# EAGLE design Hyundai giraffe (EAGLE 9.1.0)
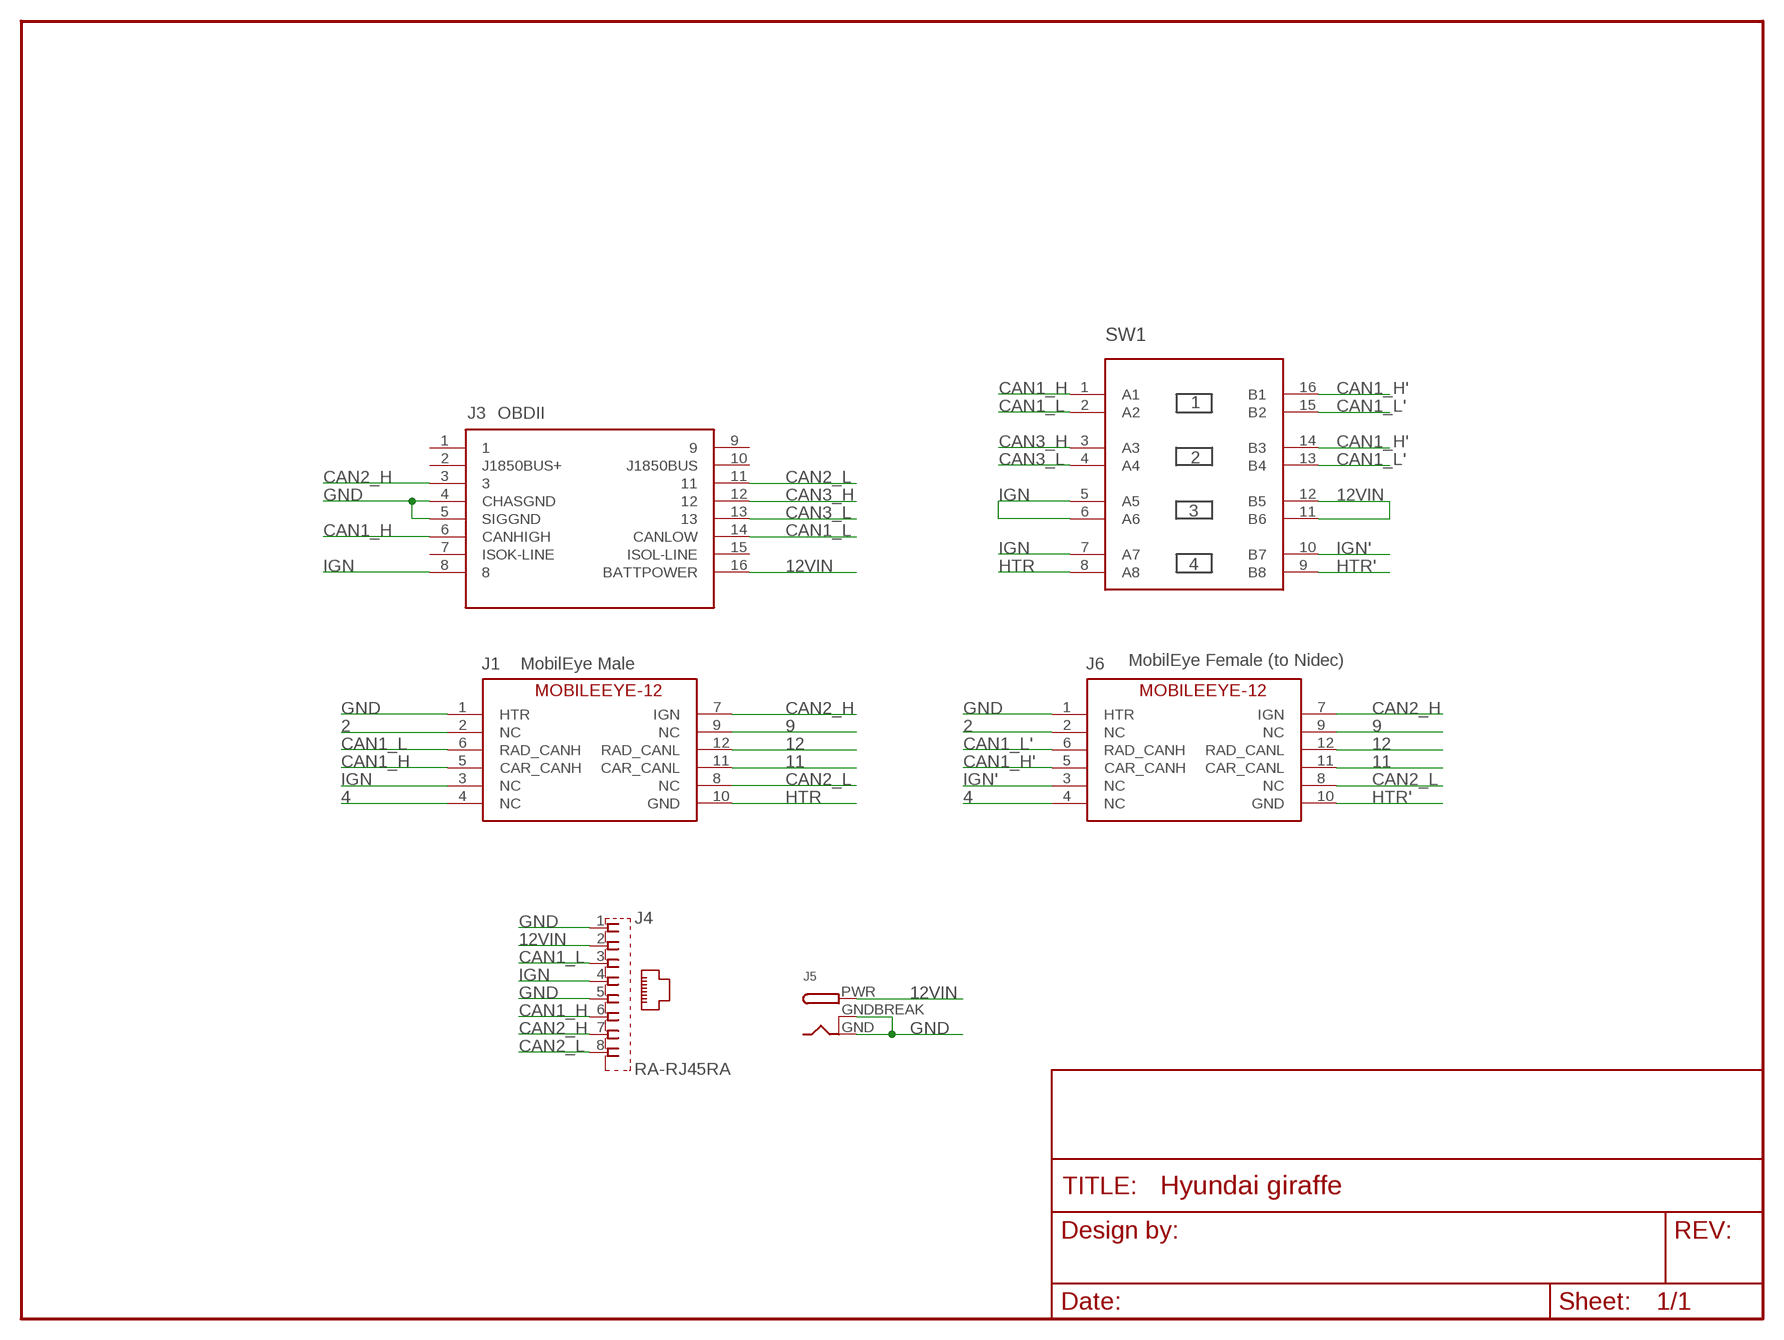
[diagram p0: schematic, sheet 1]

## Parts
FRAME1  FRAME-LETTERNO_PACKAGE  [DUMMY]
J1  COMMA.AI_MOBILEEYE-12NEW  [COMMA.AI_2X6-TE-RA_NEW]
J3  OBDII-FEMALE-CUT  [OBDII-FEMALE-MIDCUT]
J4  RA-RJ45RA  [RA-RJ45]
J5  DCBARRELPTH  [DCJACK_2MM_PTH]
J6  COMMA.AI_MOBILEEYE-12  [COMMA.AI_2X6-TE-FEMALE_NEW]
SW1  4XDPSTSMT  [4-DPST]

## Nets
2: J1.2(NC) J6.2(NC)
4: J1.4(NC) J6.4(NC)
9: J1.9(NC) J6.9(NC)
11: J1.11(CAR_CANL) J6.11(CAR_CANL)
12: J1.12(RAD_CANL) J6.12(RAD_CANL)
12VIN: J3.16(BATTPOWER) J4.2 J5.PWR SW1.11(B6) SW1.12(B5)
CAN1_H: J1.5(CAR_CANH) J3.6(CANHIGH) J4.6 SW1.1(A1)
CAN1_H': J6.5(CAR_CANH) SW1.14(B3) SW1.16(B1)
CAN1_L: J1.6(RAD_CANH) J3.14(CANLOW) J4.3 SW1.2(A2)
CAN1_L': J6.6(RAD_CANH) SW1.13(B4) SW1.15(B2)
CAN2_H: J1.7(IGN) J3.3 J4.7 J6.7(IGN)
CAN2_L: J1.8(NC) J3.11 J4.8 J6.8(NC)
CAN3_H: J3.12 SW1.3(A3)
CAN3_L: J3.13 SW1.4(A4)
GND: J1.1(HTR) J3.4(CHASGND) J3.5(SIGGND) J4.1 J4.5 J5.GND J5.GNDBREAK J6.1(HTR)
HTR: J1.10(GND) SW1.8(A8)
HTR': J6.10(GND) SW1.9(B8)
IGN: J1.3(NC) J3.8 J4.4 SW1.5(A5) SW1.6(A6) SW1.7(A7)
IGN': J6.3(NC) SW1.10(B7)
Unconnected: J3.1 J3.2(J1850BUS+) J3.7(ISOK-LINE) J3.9 J3.10(J1850BUS) J3.15(ISOL-LINE)

## Notes on the sheet
- OBDII
- MobilEye Male | MobilEye Female (to Nidec)

## Library data of the parts
FRAME1 = SparkFun-Aesthetics:FRAME-LETTER: Schematic Frame Standard 8.5x11 US Letter frame; DESIGNER: Nobody; VERSION: v01
J1 J6 = Genesis giraffe1:COMMA.AI_MOBILEEYE-12
J3 = comma.ai:OBDII-FEMALE
J4 = comma.ai:RA-RJ45
J5 = adafruit:DCBARREL: 2.0mm DC Barrel Jack DCJACK_2MM_PTH - Through Hole Jack (4UConnector: 05537)
SW1 = comma.ai:4XDPST

## Board
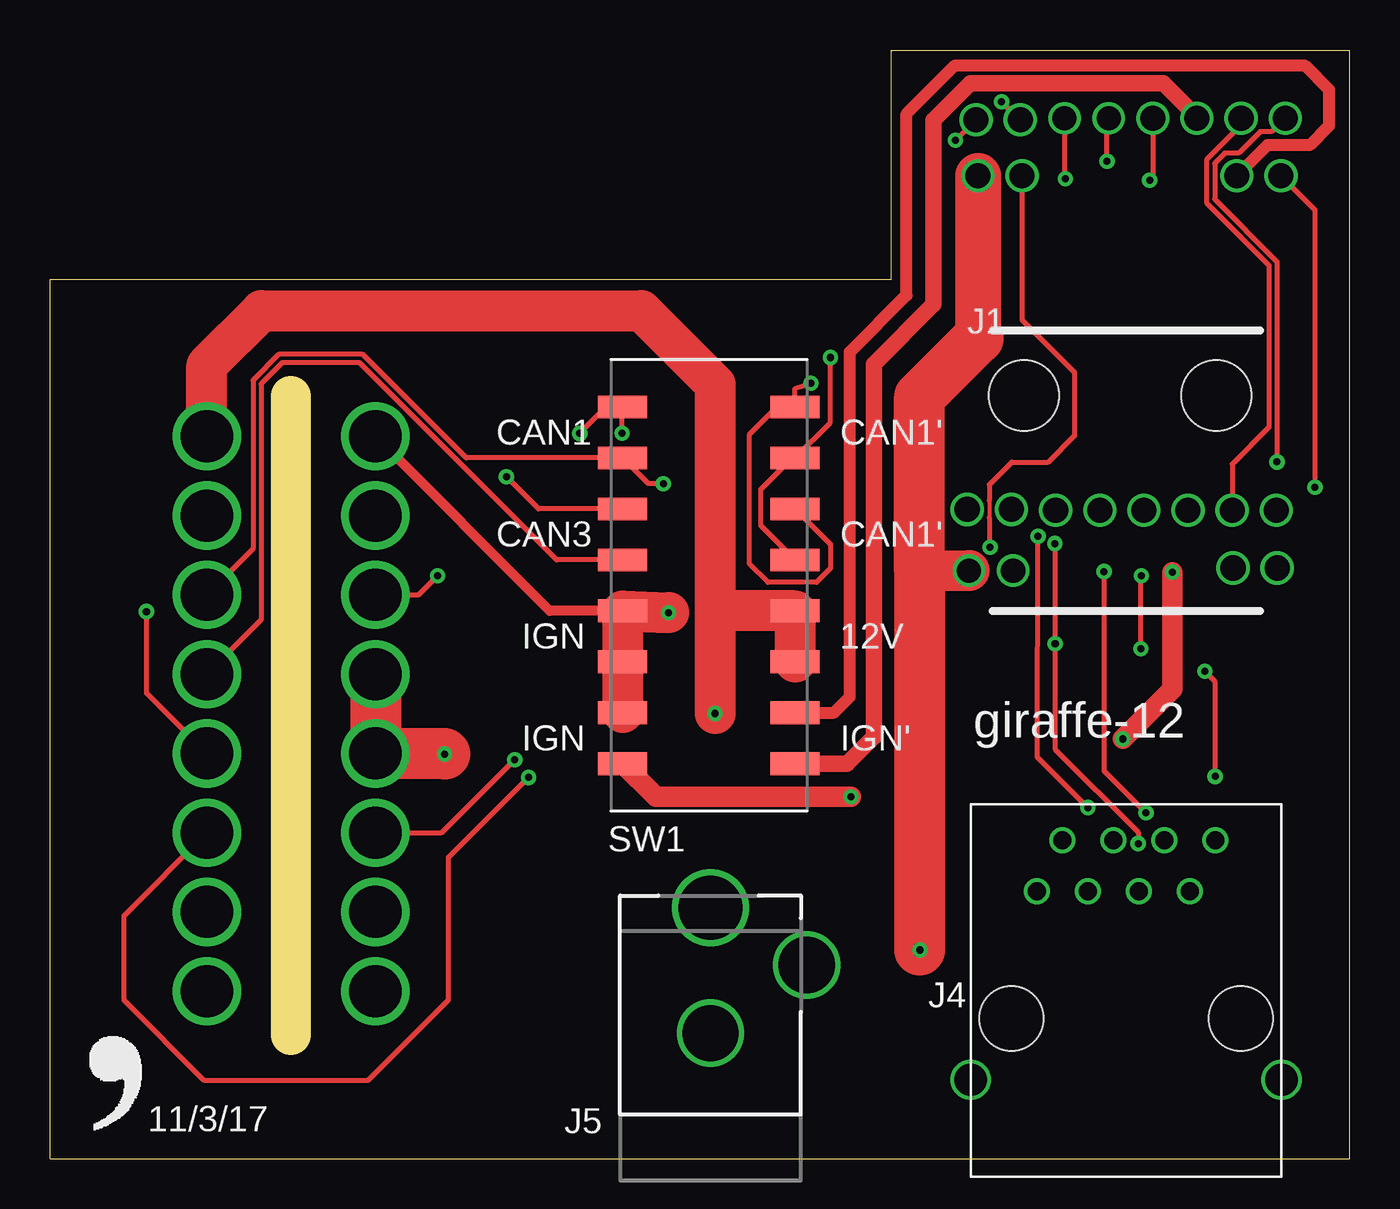
[diagram p1: board, top side]
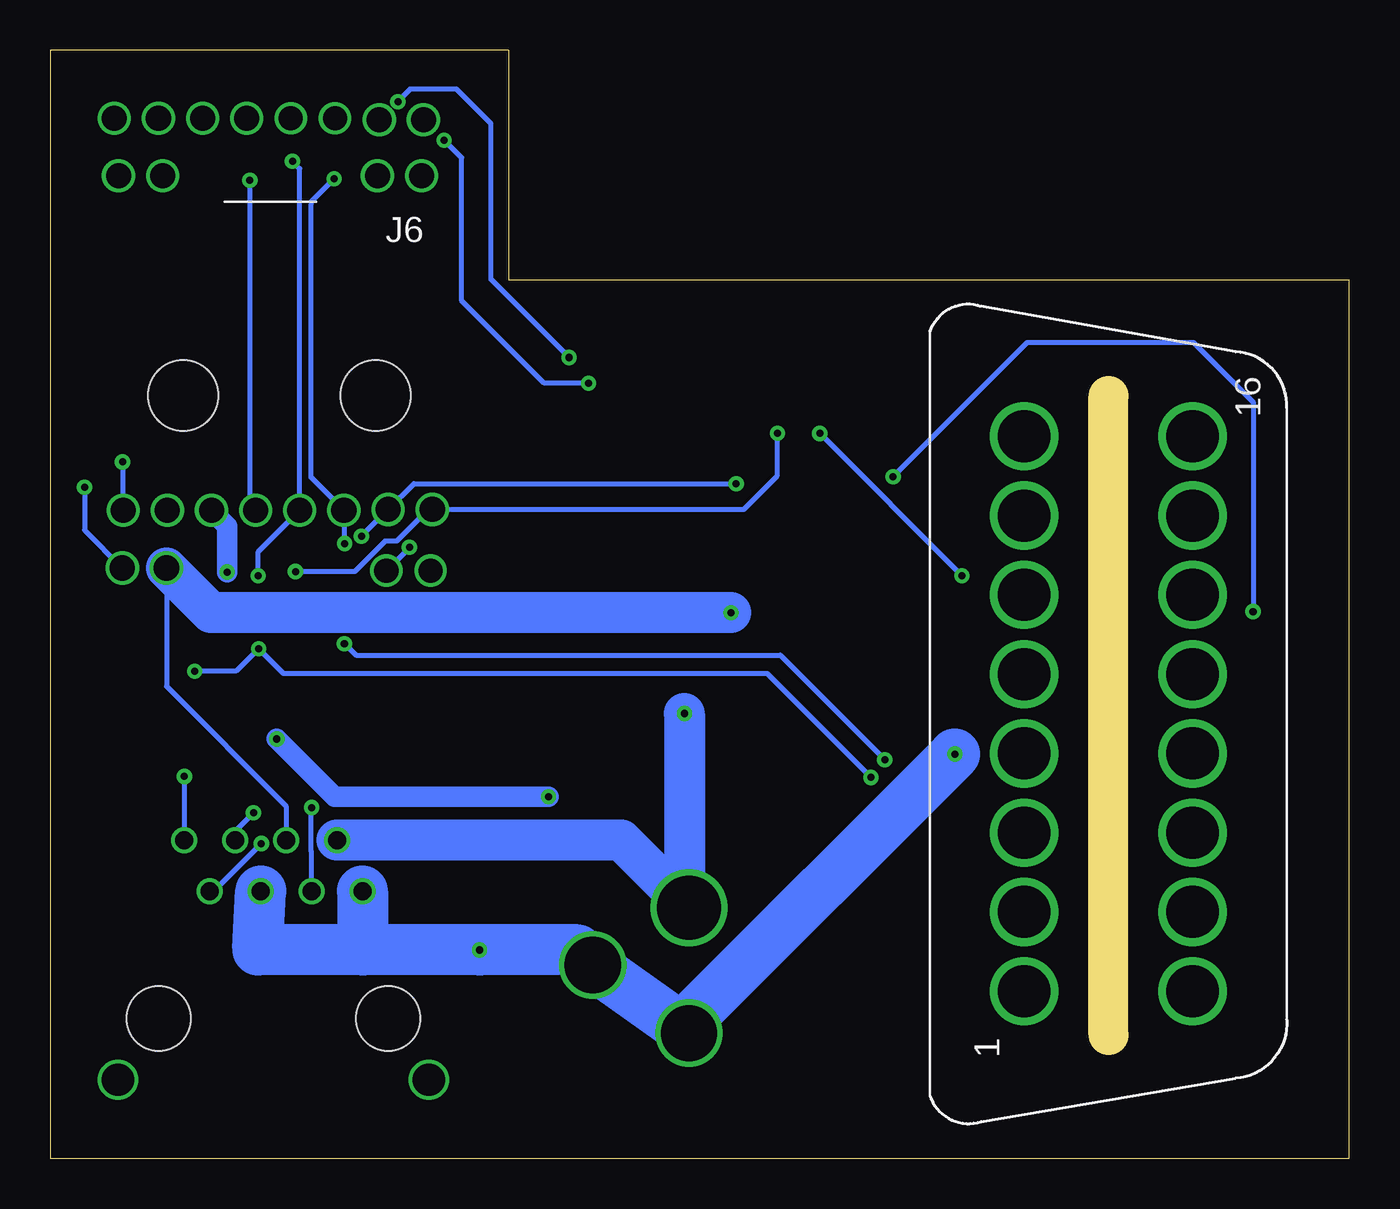
[diagram p2: board, bottom side, seen from below]

Size 64.77 x 55.24 mm. Coordinates in mm from the lower left corner, seen from the top.
Outline: 12.01,6.17 12.01,38
Outline: 41.91,55.24 64.77,55.24 64.77,0 0,0 0,43.81 41.91,43.81 41.91,55.24
Copper layers (1*16): Top 0.035mm / dielectric 1.5mm / Bottom 0.035mm
Design rules "default *": minimum track width 6mil, minimum drill 10mil, track to track 6mil, track to pad 6mil, pad to pad 6mil, via to via 6mil, smd to smd 6mil, copper to edge 15mil, drill to drill 10mil, minimum pad ring 8mil, minimum via ring 8mil, stop-mask expansion 4mil, vias tented up to drill 0mil, thermal gap 10mil

### Footprints (pad centres in the part's own frame; a part is rotated, then mirrored left to right if it is on the bottom)
COMMA.AI_2X6-TE-RA_NEW = drill 1.2: 1 -7.532,-1.627; 2 -5.332,-1.627 | drill 1.25: 3 5.631,-1.5; 4 7.831,-1.5; 5 -7.622,1.421; 6 -5.422,1.421; 7 -3.214,1.373; 8 -1.014,1.373; 9 1.186,1.373; 10 3.386,1.373; 11 5.586,1.373; 12 7.786,1.373 | hole 3.5: -4.8,7.1; 4.8,7.1
OBDII-FEMALE-MIDCUT = drill 2.6 pad 3.4: 1 13.825,-4.2; 2 9.875,-4.2; 3 5.925,-4.2; 4 1.975,-4.2; 5 -1.975,-4.2; 6 -5.925,-4.2; 7 -9.875,-4.2; 8 -13.825,-4.2; 9 13.825,4.2; 10 9.875,4.2; 11 5.925,4.2; 12 1.975,4.2; 13 -1.975,4.2; 14 -5.925,4.2; 15 -9.875,4.2; 16 -13.825,4.2
RA-RJ45 = drill 0.9: 1 -4.445,6.35; 2 -3.175,8.89; 3 -1.905,6.35; 4 -0.635,8.89; 5 0.635,6.35; 6 1.905,8.89; 7 3.175,6.35; 8 4.445,8.89 | drill 1.6: P$1 -7.75,-3.05; P$2 7.75,-3.05 | hole 3.2: -5.715,0; 5.715,0
DCJACK_2MM_PTH = drill 2.8: GND 0,7.35; GNDBREAK 4.8,10.75 | drill 3.2: PWR 0,13.6
COMMA.AI_2X6-TE-FEMALE_NEW = drill 1.25: 1 -7.532,1.754; 2 -5.332,1.754; 3 5.377,1.754; 4 7.577,1.754; 5 -7.622,-1.04; 6 -5.422,-1.04; 9 1.186,-1.119; 10 3.386,-1.119; 11 5.586,-1.119; 12 7.786,-1.119 | drill 1.2: 7 -3.214,-1.119; 8 -1.014,-1.119
4-DPST = smd 1.13 x 2.44: 1 -8.89,-4.3; 2 -6.35,-4.3; 3 -3.81,-4.3; 4 -1.27,-4.3; 5 1.27,-4.3; 6 3.81,-4.3; 7 6.35,-4.3; 8 8.89,-4.3; 9 8.89,4.3; 10 6.35,4.3; 11 3.81,4.3; 12 1.27,4.3; 13 -1.27,4.3; 14 -3.81,4.3; 15 -6.35,4.3; 16 -8.89,4.3

### Placement (x,y rotation side)
FRAME1  -8.89,-10.79 0 top  (outside the outline)
J1  53.34,30.94 0 top
J3  12.01,22.17 270 bottom
J4  53.64,6.99 0 top
J5  32.92,-1.09 0 top
J6  53.78,50.74 180 bottom
SW1  32.84,28.57 270 top
U$1  [LOGO]  1.3,1.12 0 top

### Tracks (layer width: path | path; a pad name or v marks a point on that pad's centre or on a via)
2  (via drill 0.35)
  Top 0.203: 46.82,32.8 46.82,31.95
  Top 0.254: 46.82,31.95 46.82,30.52 v46.86,30.48 | 46.82,32.8 46.82,33.59 47.94,34.71 49.76,34.71 51.07,36.02 51.07,39.19 48.45,41.81 J6.2
  Bottom 0.254: J1.2 46.86,30.46 v46.86,30.48
4  (via drill 0.35)
  Top 0.254: J6.4 63.06,47.29 v63.06,33.47
  Bottom 0.254: v63.06,33.47 63.06,31.32 J1.4
9  (via drill 0.35)
  Top 0.254: J6.9 54.97,48.92 v54.81,48.77
  Bottom 0.254: v54.81,48.77 54.81,32.6 J1.9
11
  Top 0.254: J6.11 59.37,51.5 57.65,49.77 57.65,47.65 60.76,44.54 60.76,36.45 58.93,34.62 J1.11
12  (via drill 0.35)
  Top 0.254: J6.12 60.9,51.18 60.33,51.18 59.26,50.11 58.56,50.11 58.05,49.61 58.05,47.82 61.16,44.7 v61.16,34.72
  Bottom 0.254: v61.16,34.72 61.16,32.35 J1.12
12VIN  (via drill 0.35)
  Top 2.032: J3.16 7.81,39.54 10.54,42.27 29.48,42.27 33.15,38.59 33.15,27.18 | 33.15,27.18 v33.15,22.19 | SW1.11 SW1.12 33.27,27.3 33.15,27.18
  Bottom 2.032: v33.15,22.19 33.15,12.74 J5.PWR 36.29,15.88 J4.2
CAN1_H  (via drill 0.35)
  Top 0.254: J3.6 18.36,28.1 v19.32,29.06 | v28.51,36.16 28.51,37.43 SW1.1 27.72,37.47 v26.4,36.14 | v52.54,29.26 52.54,19.33 v54.63,17.23
  Bottom 0.254: v19.32,29.06 v26.4,36.14 | v28.51,36.16 28.51,34.04 30.19,32.36 J1.5 45.91,32.36 47.5,30.77 48.08,30.77 49.59,29.26 v52.54,29.26 | v54.63,17.23 55.55,16.32 J4.6
CAN1_H'  (via drill 0.35)
  Top 0.254: SW1.14 38.91,30.61 38.91,29.43 38.2,28.73 35.78,28.73 34.87,29.63 34.87,36.11 36.23,37.47 SW1.16 37.14,38.39 v37.92,38.65 | v45.12,50.76 45.15,50.76 J6.5
  Bottom 0.254: v37.92,38.65 40.15,38.65 44.25,42.75 44.25,49.89 v45.12,50.76
CAN1_L  (via drill 0.35)
  Top 0.254: J3.14 10.11,30.39 10.11,38.79 11.4,40.08 15.59,40.08 20.74,34.92 SW1.2 29.82,33.64 v30.57,33.64 | v51.73,17.5 49.21,20.02 v49.25,31.03
  Bottom 0.254: v30.57,33.64 46.63,33.64 J1.6 49.21,31.06 v49.25,31.03 | J4.3 51.73,15.31 51.76,15.34 51.76,17.47 v51.73,17.5
CAN1_L'  (via drill 0.35)
  Top 0.254: SW1.13 35.43,31.55 35.43,33.36 36.99,34.92 SW1.15 38.9,36.68 v38.9,39.93 | v47.43,52.67 48.33,51.78 J6.6
  Bottom 0.254: v38.9,39.93 42.8,43.83 42.8,51.59 44.51,53.3 46.84,53.3 47.43,52.7 v47.43,52.67
CAN2_H  (via drill 0.35)
  Top 0.254: J3.3 19.53,16.25 v23.16,19.89 | v50.09,30.66 50.1,30.64 v50.1,25.67 50.1,20.41 54.24,16.27 v54.24,15.71 | J6.7 50.57,48.88 v50.61,48.84
  Bottom 0.254: v50.09,30.66 50.13,30.7 J1.7 51.77,33.95 51.77,47.42 51.77,47.56 51.77,47.69 v50.61,48.84 | v23.16,19.89 28.37,25.09 49.53,25.09 v50.1,25.67 | v54.24,15.71 56.61,13.34 J4.7
CAN2_L  (via drill 0.35)
  Top 0.254: v23.85,19 19.85,15 19.85,7.9 15.84,3.89 7.68,3.89 3.68,7.89 3.68,12.12 J3.11 | v54.38,25.42 54.38,29.05 v54.39,29.06 | v52.69,49.71 52.69,51.78 J6.8 | v57.57,24.3 58.06,23.8 58.06,19.07 v58.08,19.05
  Bottom 0.254: v23.85,19 29.03,24.18 53.15,24.18 v54.38,25.42 55.5,24.3 v57.57,24.3 | v54.39,29.06 54.39,30.24 J1.8 52.33,49.34 v52.69,49.71 | v58.08,19.05 58.08,15.88 J4.8
CAN3_H  (via drill 0.35)
  Top 0.254: SW1.3 24.35,32.38 v22.75,33.98 | v4.8,27.27 4.8,23.21 J3.12
  Bottom 0.254: v22.75,33.98 16.05,40.68 7.77,40.68 4.8,37.71 v4.8,27.27
CAN3_L
  Top 0.254: SW1.4 25.25,29.84 15.42,39.67 11.57,39.67 10.52,38.62 10.52,26.85 J3.13
GND  (via drill 0.35)
  Top 2.032: J1.1 43.34,29.27
  Top 2.286: J6.1 46.25,40.88
  Top 2.54: J3.5 J3.4 19.64,20.2 v19.67,20.17 | 46.25,40.88 43.34,37.97 43.34,29.27 43.34,10.42 v43.36,10.4
  Bottom 2.54: v19.67,20.17 32.92,6.92 J5.GND J5.GNDBREAK 38.46,10.4 v43.36,10.4 49.19,10.4 | 49.19,10.4 54.42,10.4 J4.5 | J4.1 49.19,10.4
HTR  (via drill 0.35)
  Top 1.016: SW1.8 30.19,18.03 v39.93,18.03 | v53.47,20.92 55.94,23.39 v55.94,29.23
  Bottom 1.016: v39.93,18.03 50.58,18.03 v53.47,20.92 | v55.94,29.23 55.94,31.53 J1.10
HTR'
  Top 0.813: SW1.9 39.73,19.68 41.06,21.02 41.06,39.6 44.04,42.58 44.04,51.76 45.89,53.61 46.85,53.61 55.5,53.61 57.17,51.94
  Top 1.016: 57.17,51.94 J6.10
IGN  (via drill 0.35)
  Top 0.508: SW1.5 24.91,27.3 J3.8
  Top 2.032: SW1.7 SW1.6 SW1.5 v30.84,27.22
  Bottom 0.254: J1.3 58.97,23.54 53.01,17.58 J4.4
  Bottom 2.032: v30.84,27.22 56.75,27.22 J1.3
IGN'
  Top 0.61: SW1.10 39.08,22.23 39.87,23.01 39.87,40.2 42.7,43.03 42.7,52.07 45.11,54.48 62.55,54.48 63.75,53.28 63.75,51.47 62.79,50.51 60.69,50.51 J6.3

### Text on the board
tPlace: CAN1 | CAN1' | CAN3 | CAN1' | IGN | 12V | giraffe-12 | IGN | IGN' | 11/3/17